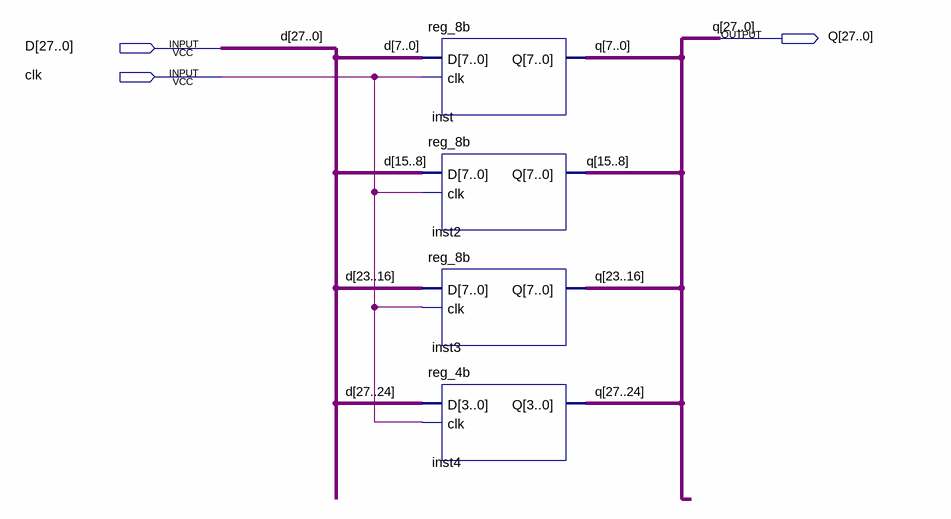
[diagram p0: schematic sheet]
// Quartus schematic reg_28b.bdf as structural Verilog: 4 symbols, 3 pins
module reg_28b (
  input  [27:0] D,
  input  clk,
  output [27:0] Q
);

  reg_8b inst (.D(D[7:0]), .clk(clk), .Q(Q[7:0]));
  reg_8b inst2 (.D(D[15:8]), .clk(clk), .Q(Q[15:8]));
  reg_8b inst3 (.D(D[23:16]), .clk(clk), .Q(Q[23:16]));
  reg_4b inst4 (.D(D[27:24]), .clk(clk), .Q(Q[27:24]));
endmodule
